# EasyEDA schematic SCH_Vex-Field-Controller_2025-05-28.json
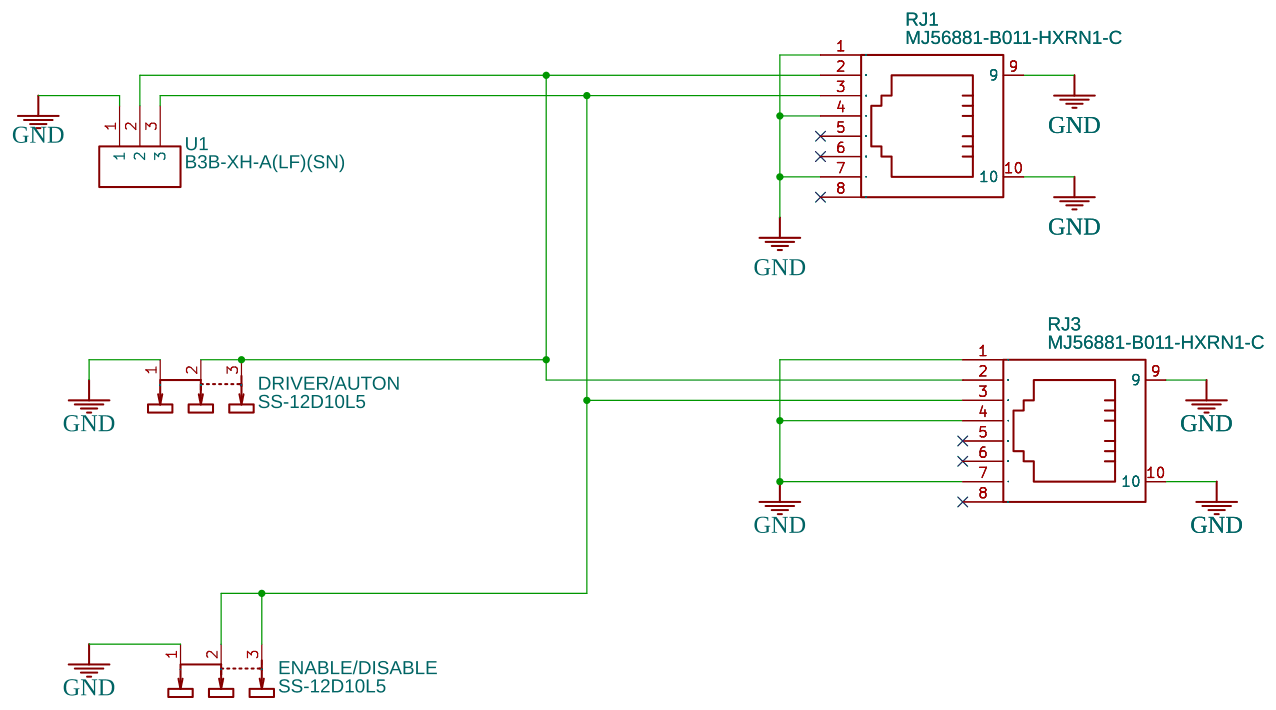
[diagram p0: schematic sheet]

## Parts
DRIVER/AUTON  SS-12D10L5  [SW-TH_SS-12D10L5]
ENABLE/DISABLE  SS-12D10L5  [SW-TH_SS-12D10L5]
RJ1  MJ56881-B011-HXRN1-C  [RJ45-SMD_MJ56881-B011-HXRN1-C]
RJ3  MJ56881-B011-HXRN1-C  [RJ45-SMD_MJ56881-B011-HXRN1-C]
U1  B3B-XH-A(LF)(SN)  [CONN-TH_3P-P2.50_A2501WV2-3P]

## Library data of the parts
DRIVER/AUTON ENABLE/DISABLE = SS-12D10L5: Contributor: LCSC; Supplier: LCSC; Supplier Part: C319012; Manufacturer: XKB Connectivity(中国星坤); JLCPCB Part Class: Extended Part
RJ1 RJ3 = MJ56881-B011-HXRN1-C: Contributor: LCSC; Supplier: LCSC; Supplier Part: C501473; Manufacturer: Heling(合陵); Manufacturer Part: MJ56881-B011-HLRN1-C; JLCPCB Part Class: Extended Part
U1 = B3B-XH-A(LF)(SN): Contributor: LCSC; Supplier: LCSC; Supplier Part: C144394; Manufacturer: JST; JLCPCB Part Class: Extended Part

## Nets
GND: DRIVER/AUTON.1 ENABLE/DISABLE.1 RJ1.1 RJ1.4 RJ1.7 RJ1.9 RJ1.10 RJ3.1 RJ3.4 RJ3.7 RJ3.9 RJ3.10 U1.1
Net-(DRIVER/AUTON-2): DRIVER/AUTON.2 DRIVER/AUTON.3 RJ1.2 RJ3.2 U1.2
Net-(ENABLE/DISABLE-2): ENABLE/DISABLE.2 ENABLE/DISABLE.3 RJ1.3 RJ3.3 U1.3

Not connected (* = marked no-connect by the designer): RJ1 5* 6* 8*; RJ3 5* 6* 8*
